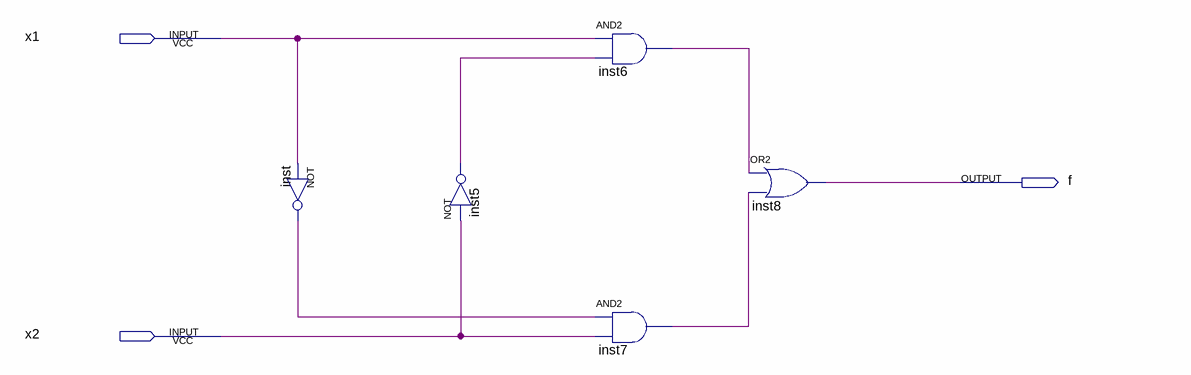
[diagram p0: schematic sheet]
// Quartus schematic light.bdf as structural Verilog: 5 symbols, 3 pins
module light (
  input  x1,
  input  x2,
  output f
);

  wire inst5_out, inst6_out, inst7_out, inst_out;

  not inst (inst_out, x1);
  not inst5 (inst5_out, x2);
  and inst6 (inst6_out, x1, inst5_out);
  and inst7 (inst7_out, inst_out, x2);
  or inst8 (f, inst6_out, inst7_out);
endmodule
